# EAGLE design ATMEGA8 (EAGLE 9.4.2)
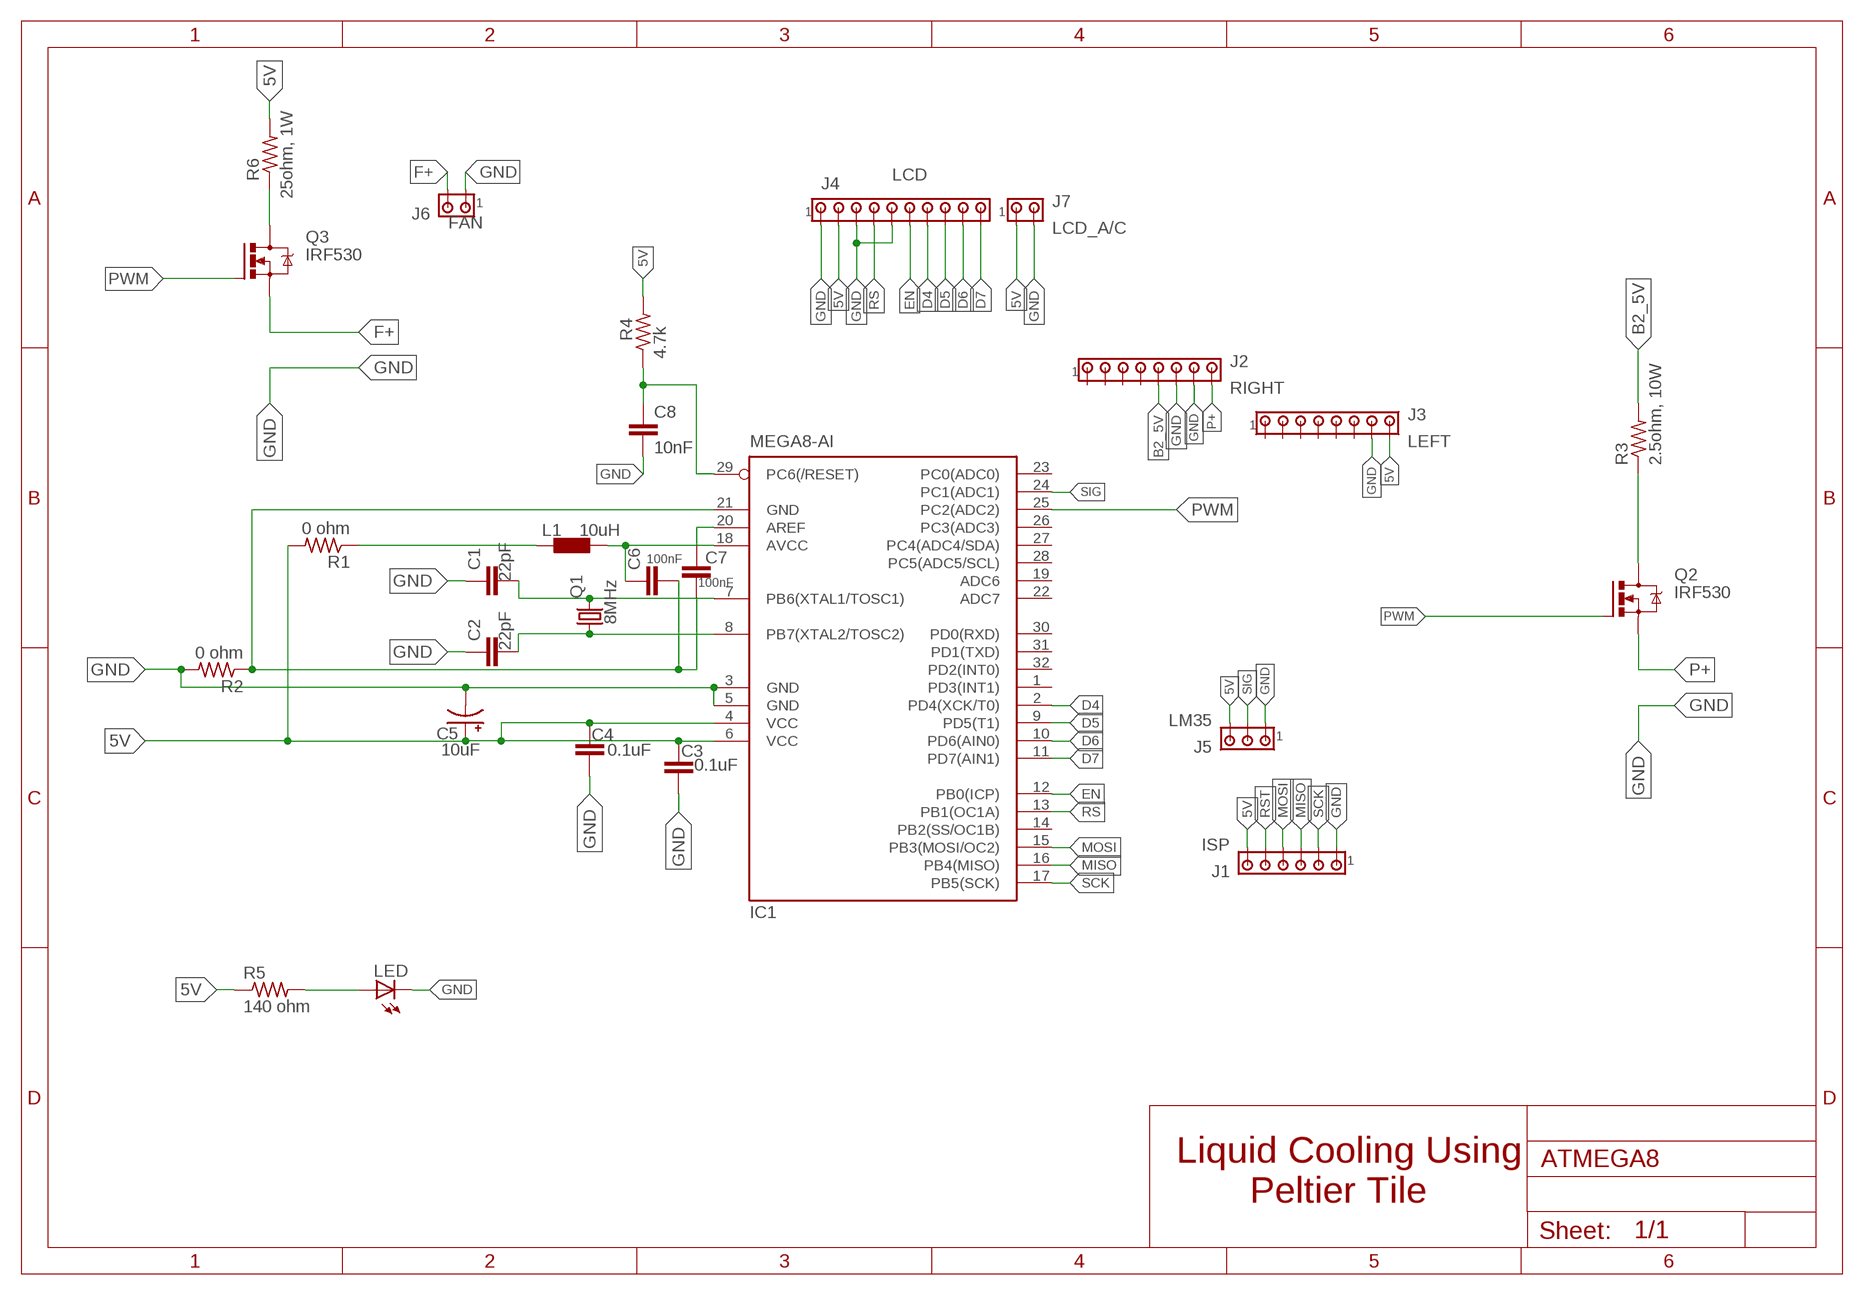
[diagram p0: schematic, sheet 1]

## Parts
C1  22pF  C-EUC0805  [C0805]
C2  22pF  C-EUC0805  [C0805]
C3  0.1uF  C-EUC0805  [C0805]
C4  0.1uF  C-EUC0805  [C0805]
C5  10uF  CPOL-USA/3216-18R  [A/3216-18R]
C6  100nF  C-EUC0805  [C0805]
C7  100nF  C-EUC0805  [C0805]
C8  10nF  C-EUC0805  [C0805]
IC1  MEGA8-AI  [TQFP32-08]
J1  ISP  MTA06-100  [10X06MTA]
J2  RIGHT  MTA08-100  [10X08MTA]
J3  LEFT  MTA08-100  [10X08MTA]
J4  LCD  MTA10-100  [10X10MTA]
J5  LM35  MTA03-100  [10X03MTA]
J6  FAN  MTA02-100  [10X02MTA]
J7  LCD_A/C  MTA02-100  [10X02MTA]
L1  10uH  L0204/7  [0204/7]
LED  RED  LEDCHIPLED_1206  [CHIPLED_1206]
Q1  8MHz  CSM-7X-DU  [CSM-7X-DU]
Q2  IRF530  [TO220BV]
Q3  IRF530  [TO220BV]
R1  0 ohm  R-US_M0805  [M0805]
R2  0 ohm  R-US_M0805  [M0805]
R3  2.5ohm, 10W  R-US_0207/9  [0207/9]
R4  4.7k  R-US_M0805  [M0805]
R5  140 ohm  R-US_M0805  [M0805]
R6  25ohm, 1W  R-US_0207/10  [0207/10]

## Nets
5V: C3.1 C4.1 C5.+ IC1.4(VCC) IC1.6(VCC) J1.6 J3.8 J4.2 J5.3 J7.1 R1.2 R4.2 R5.1 R6.2
B2_5V: J2.5 R3.2
D4: IC1.2(PD4(XCK/T0)) J4.7
D5: IC1.9(PD5(T1)) J4.8
D6: IC1.10(PD6(AIN0)) J4.9
D7: IC1.11(PD7(AIN1)) J4.10
EN: IC1.12(PB0(ICP)) J4.6
F+: J6.2 Q3.S
GND: C1.1 C2.1 C3.2 C4.2 C5.- C8.2 IC1.3(GND) IC1.5(GND) J1.1 J2.6 J2.7 J3.7 J4.1 J4.3 J4.5 J5.1 J6.1 J7.2 LED.C R2.2
MISO: IC1.16(PB4(MISO)) J1.3
MOSI: IC1.15(PB3(MOSI/OC2)) J1.4
N$1: C1.2 IC1.7(PB6(XTAL1/TOSC1)) Q1.2
N$2: C2.2 IC1.8(PB7(XTAL2/TOSC2)) Q1.1
N$3: C6.1 IC1.18(AVCC) L1.2
N$4: Q2.D R3.1
N$5: L1.1 R1.1
N$6: C6.2 C7.2 IC1.21(GND) R2.1
N$7: C7.1 IC1.20(AREF)
N$8: C8.1 IC1.29(PC6(/RESET)) R4.1
N$9: LED.A R5.2
N$10: Q3.D R6.1
P+: J2.8 Q2.S
PWM: IC1.25(PC2(ADC2)) Q2.G Q3.G
RS: IC1.13(PB1(OC1A)) J4.4
RST: J1.5
SCK: IC1.17(PB5(SCK)) J1.2
SIG: IC1.24(PC1(ADC1)) J5.2
Unconnected: IC1.1(PD3(INT1)) IC1.14(PB2(SS/OC1B)) IC1.19(ADC6) IC1.22(ADC7) IC1.23(PC0(ADC0)) IC1.26(PC3(ADC3)) IC1.27(PC4(ADC4/SDA)) IC1.28(PC5(ADC5/SCL)) IC1.30(PD0(RXD)) IC1.31(PD1(TXD)) IC1.32(PD2(INT0)) J2.1 J2.2 J2.3 J2.4 J3.1 J3.2 J3.3 J3.4 J3.5 J3.6

## Notes on the sheet
- Liquid Cooling Using
         Peltier Tile

## Library data of the parts
C1-C4 C6-C8 = rcl:C-EU: CAPACITOR, European symbol; SPICEPREFIX: C
C5 = rcl:CPOL-US: POLARIZED CAPACITOR, American symbol; SPICEPREFIX: C
IC1 = atmel:MEGA8: MICROCONTROLLER 8 Kbytes FLASH, 1 kbytes SRAM, 512 bytes EEPROM, USART, 6-channel 10 bit ADC, 2-channel 8 bit ADC Pin compatible with Atmega48, ATMega88, ATMega168 Source: avr.lbr; MPN: ATMEGA8-16AU; OC_FARNELL: 9171371; OC_NEWARK: 73M8863
J1 = con-amp:MTA06-100: AMP connector Connection corrected 2014-09-19
J2 J3 = con-amp:MTA08-100: AMP connector
J4 = con-amp:MTA10-100: AMP connector
J5 = con-amp:MTA03-100: AMP connector
J6 J7 = con-amp:MTA02-100: AMP connector
L1 = eagle-ltspice:L: INDUCTOR, European symbol; SPICEMODEL: NONE; SPICEPREFIX: L
LED = adafruit:LED: LED OSRAM: - CHIPLED LG R971, LG N971, LY N971, LG Q971, LY Q971, LO R971, LY R971 LH N974, LH R974 LS Q976, LO Q976, LY Q976 LO Q996 - Hyper CHIPLED LW Q18S LB Q993, LB Q99A, LB R99A - SideLED LS A670, LO A670, LY A670, LG A670, LP A670 LB A673, LV A673, LT A673, LW A673 LH A674 LY A675 LS A676, LA A676, LO A676, LY A676, LW A676 LS A679, LY A679, LG A679 - Hyper Micro SIDELED® LS Y876, LA Y876, LO Y876, LY Y876 LT Y87S - SmartLED LW L88C, LW L88S LB L89C, LB L89S, LG L890 LS L89K, LO L89K, LY L89K LS L896, LA L896, LO L896, LY L896 - TOPLED LS T670, LO T670, LY T670, LG T670, LP T670 LSG T670, LSP T670, LSY T670, LOP T670, LYG T670 LG T671, LOG T671, LSG T671 LB T673, LV T673, LT T673, LW T673 LH T674 LS T676, LA T676, LO T676, LY T676, LB T676, LH T676, LSB T676, LW T676 LB T67C, LV T67C, LT T67C, LS T67K, LO T67K, LY T67K, LW E67C LS E67B, LA E67B, LO E67B, LY E67B, LB E67C, LV E67C, LT E67C LW T67C LS T679, LY T679, LG T679 LS T770, LO T770, LY T770, LG T770, LP T770 LB T773, LV T773, LT T773, LW T773 LH T774 LS E675, LA E675, LY E675, LS T675 LS T776, LA T776, LO T776, LY T776, LB T776 LHGB T686 LT T68C, LB T68C - Hyper Mini TOPLED® LB M676 - Mini TOPLED Santana® LG M470 LS M47K, LO M47K, LY M47K Source: http://www.osram.convergy.de/
Q1 = crystal:CSM-7X-DU: SMD CRYSTAL Source: www.ecsxtal.com .. Crystal 3.6864MHz CSM_7X_DU.PDF; OC_FARNELL: unknown; OC_NEWARK: unknown
Q2 Q3 = transistor-power:IRF530: HEXFET Power MOSFET
R1 R2 R4 R5 = rcl:R-US_: RESISTOR, American symbol; SPICEPREFIX: R
R3 R6 = adafruit:R-US_: RESISTOR, American symbol

## Board
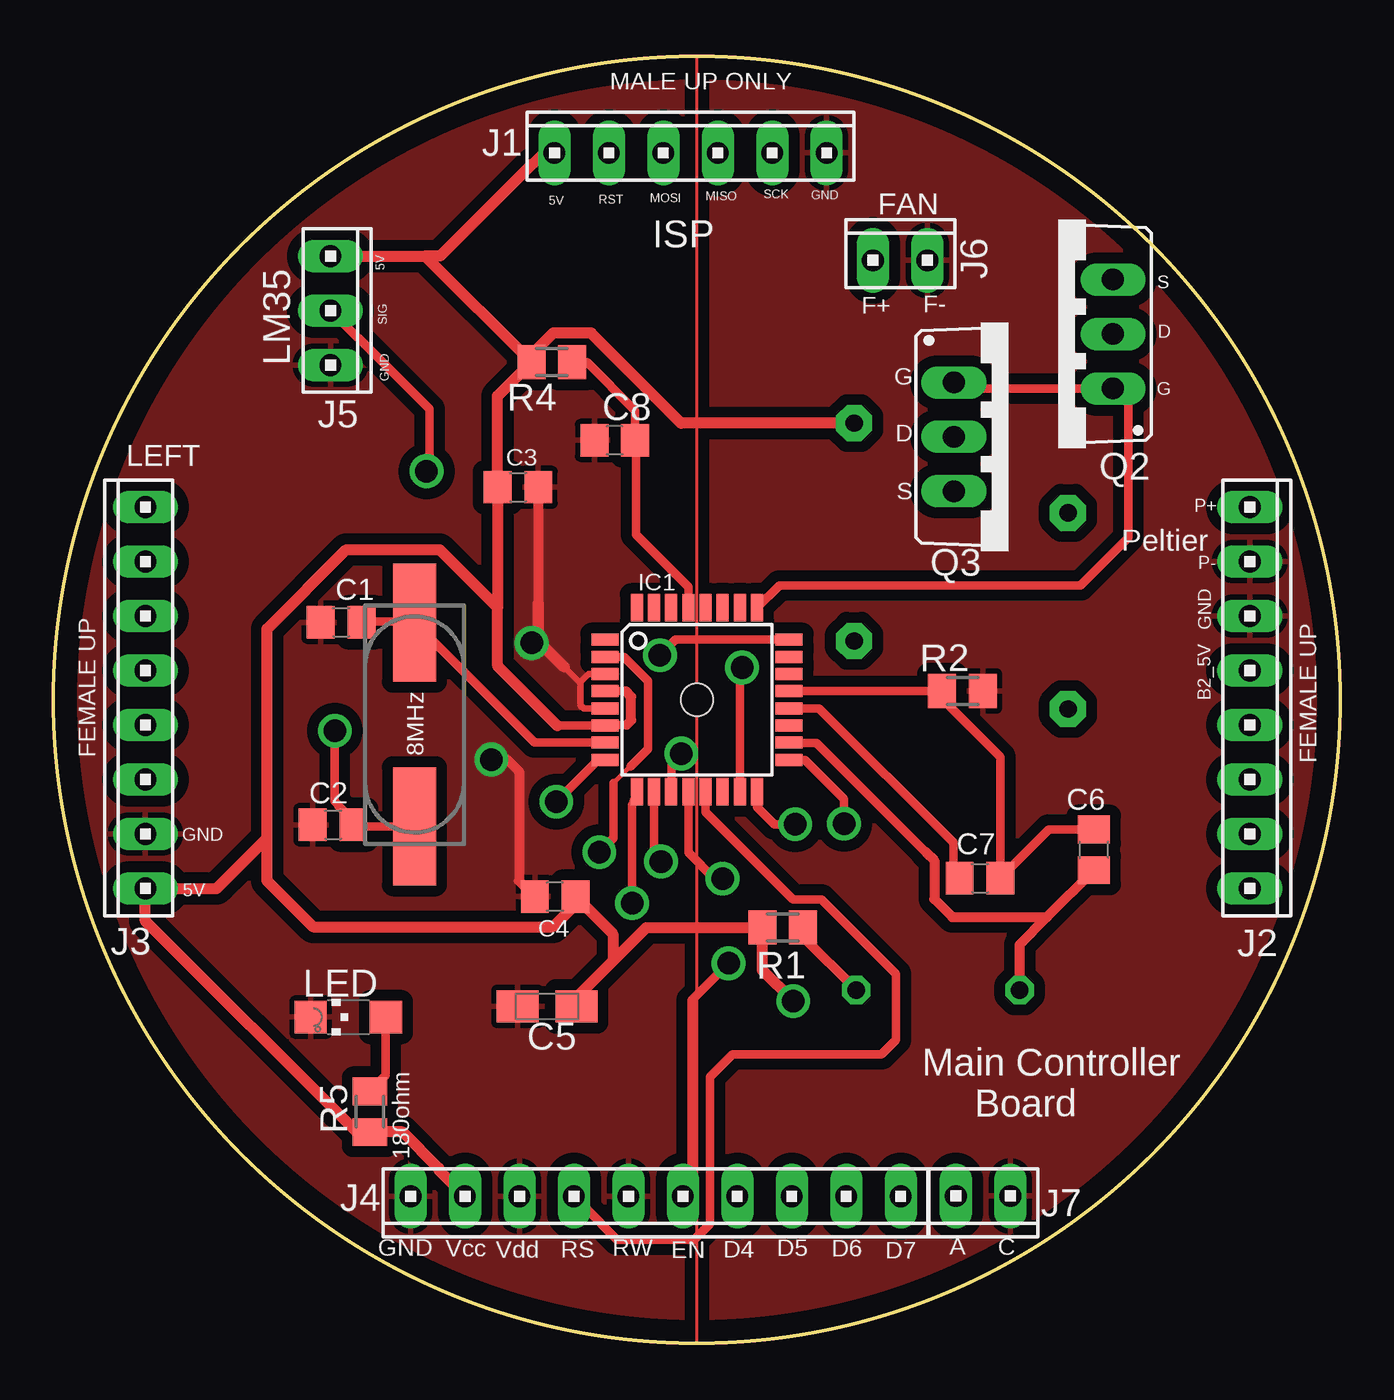
[diagram p1: board, top side]
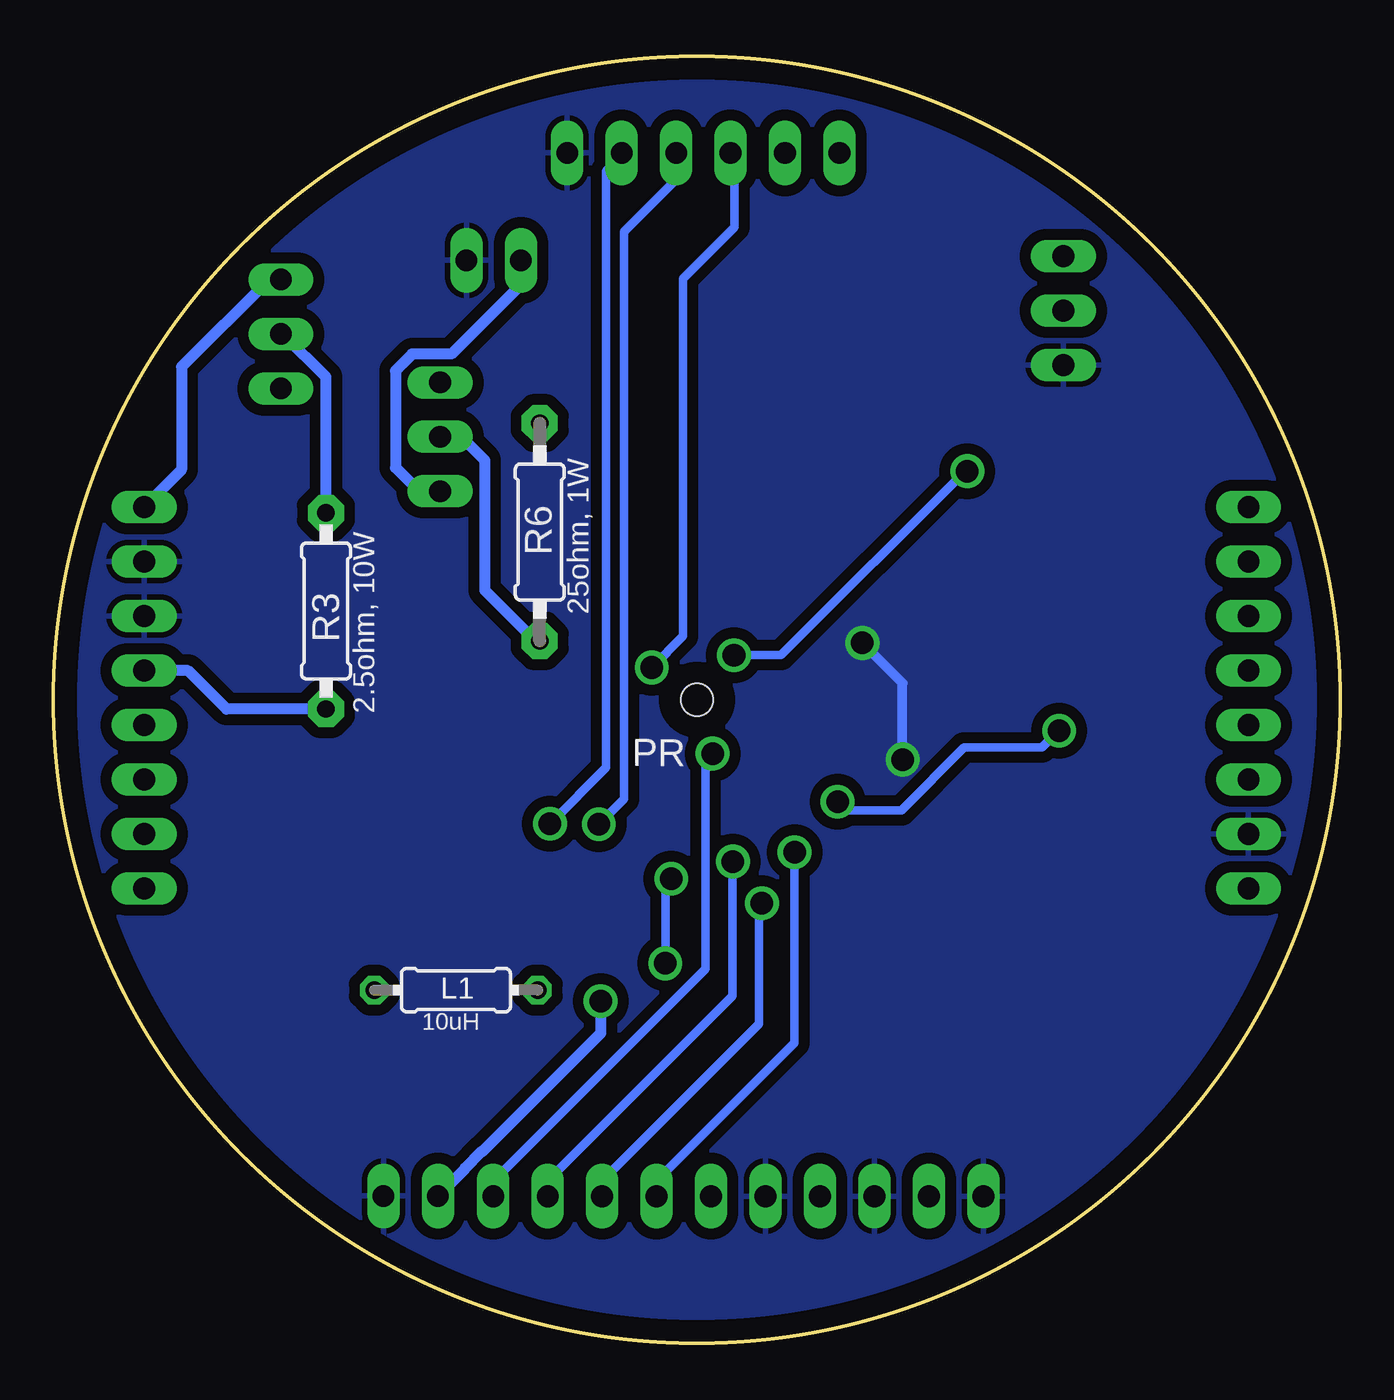
[diagram p2: board, bottom side, seen from below]

Size 60 x 60 mm. Coordinates in mm from the lower left corner, seen from the top.
Outline: circle at 30,30 radius 30
Copper layers (1*16): Top 0.035mm / dielectric 1.5mm / Bottom 0.035mm
Design rules "default *": minimum track width 8mil, minimum drill 0.35mm, track to track 12mil, track to pad 12mil, pad to pad 8mil, via to via 8mil, smd to smd 8mil, copper to edge 40mil, drill to drill 6mil, minimum pad ring 10mil, minimum via ring 8mil, stop-mask expansion 4mil, vias tented up to drill 0mil, thermal gap 10mil
Holes 1.5 mm at 30,30

### Footprints (pad centres in the part's own frame; a part is rotated, then mirrored left to right if it is on the bottom)
C0805 = smd 1.3 x 1.5: 1 -0.95,0; 2 0.95,0
A/3216-18R = smd 1.95 x 1.5: + 1.375,0; - -1.375,0
TQFP32-08 = smd 1.27 x 0.559: 1 -4.293,2.8; 2 -4.293,2; 3 -4.293,1.2; 4 -4.293,0.4; 5 -4.293,-0.4; 6 -4.293,-1.2; 7 -4.293,-2; 8 -4.293,-2.8; 17 4.293,-2.8; 18 4.293,-2; 19 4.293,-1.2; 20 4.293,-0.4; 21 4.293,0.4; 22 4.293,1.2; 23 4.293,2; 24 4.293,2.8 | smd 0.559 x 1.27: 9 -2.8,-4.293; 10 -2,-4.293; 11 -1.2,-4.293; 12 -0.4,-4.293; 13 0.4,-4.293; 14 1.2,-4.293; 15 2,-4.293; 16 2.8,-4.293; 25 2.8,4.293; 26 2,4.293; 27 1.2,4.293; 28 0.4,4.293; 29 -0.4,4.293; 30 -1.2,4.293; 31 -2,4.293; 32 -2.8,4.293
10X06MTA = drill 1.016 long: 1 6.35,0; 2 3.81,0; 3 1.27,0; 4 -1.27,0; 5 -3.81,0; 6 -6.35,0
10X08MTA = drill 1.016 long: 1 8.89,0; 2 6.35,0; 3 3.81,0; 4 1.27,0; 5 -1.27,0; 6 -3.81,0; 7 -6.35,0; 8 -8.89,0
10X10MTA = drill 1.016 long: 1 11.43,0; 2 8.89,0; 3 6.35,0; 4 3.81,0; 5 1.27,0; 6 -1.27,0; 7 -3.81,0; 8 -6.35,0; 9 -8.89,0; 10 -11.43,0
10X03MTA = drill 1.016 long: 1 2.54,0; 2 0,0; 3 -2.54,0
10X02MTA = drill 1.016 long: 1 1.27,0; 2 -1.27,0
0204/7 = drill 0.813 octagon: 1 -3.81,0; 2 3.81,0
CHIPLED_1206 = smd 1.5 x 1.5: A 0,-1.75; C 0,1.75
CSM-7X-DU = smd 5.5 x 2: 1 -4.75,0; 2 4.75,0
TO220BV = drill 1.016 long: D 0,-2.54; G -2.54,-2.54; S 2.54,-2.54
M0805 = smd 1.3 x 1.6: 1 -0.95,0; 2 0.95,0
0207/9 = drill 0.813 pad 1.676 octagon: 1 -4.572,0; 2 4.572,0
0207/10 = drill 0.813 pad 1.676 octagon: 1 -5.08,0; 2 5.08,0

### Placement (x,y rotation side)
C1  13.41,33.61 0 top
C2  13.03,24.17 0 top
C3  21.65,39.91 0 top
C4  23.39,20.82 180 top
C5  23.01,15.7 0 top
C6  48.51,23 90 top
C7  43.2,21.68 0 top
C8  26.17,42.1 180 top
IC1  30,30 0 top
J1  29.7,55.5 0 top
J2  55.78,30.09 270 top
J3  4.28,30.09 90 top
J4  28.07,6.85 180 top
J5  12.91,48.15 270 top
J6  39.48,50.49 0 top
J7  43.35,6.86 180 top
L1  41.24,16.46 180 bottom
LED  13.74,15.2 90 top
Q1  16.83,28.85 90 top
Q2  46.86,47.06 90 top
Q3  44.52,42.26 270 top
R1  34,19.38 180 top
R2  42.38,30.41 0 top
R3  47.3,34.14 270 bottom
R4  23.23,45.74 180 top
R5  14.75,10.79 90 top
R6  37.33,37.82 90 bottom

### Tracks (layer width: path | path; a pad name or v marks a point on that pad's centre or on a via)
5V  (via drill 1.05)
  Top 0.406: 23.48,28.8 IC1.6 25.72,28.81 26.7,28.81 26.73,28.84 | 26.67,30.4 IC1.4
  Top 0.457: 26.67,30.4 26.93,30.14 26.93,29.04 26.73,28.84 | C4.1 24.65,20.51 24.38,20.51 | C5.+ 24.38,16.13 | 22.36,45.82 R4.2 | 22.36,55.02 22.84,55.5 J1.6
  Top 0.508: 23.48,28.8 20.71,31.57 20.71,34.3 | 20.71,34.3 C3.1 20.7,44.16 R4.2 17.33,50.69 | 24.38,16.13 26.09,17.83 | 26.09,17.83 27.64,19.38 R1.2 33.05,17.39 v34.49,15.95 | J5.3 17.33,50.69 | 20.71,34.3 18.01,37 13.64,37 9.95,33.31 9.95,23.55 | 9.95,23.55 9.95,21.56 12.1,19.41 23.28,19.41 24.38,20.51 | C4.1 26.09,19.08 26.09,17.83 | 9.95,23.55 7.6,21.2 J3.8 4.28,19.68 14.12,9.84 R5.1 16.28,9.84 17.96,8.16 17.96,8.07 J4.2 | R6.2 29.26,42.9 25.06,47.1 23.3,47.1 22.36,46.16 22.36,45.82 | 22.36,55.02 18.03,50.69 17.33,50.69
  Bottom 0.508: J7.1 40.82,8.12 40.82,8.16 40.05,8.93 40.01,8.93 34.48,14.46 v34.48,15.95 v34.49,15.95
B2_5V
  Bottom 0.508: R3.2 51.94,29.57 53.73,31.36 J2.5
D4  (via drill 1.05)
  Top 0.203: 27.72,27.71 27.72,27.73 | 26.89,26.89 26.88,26.89 26.12,26.12
  Top 0.406: 27.72,27.73 27.72,30.88 26.6,32 IC1.2 | 26.12,26.12 26.12,23.56 v25.45,22.89 | 26.89,26.89 27.72,27.71
  Bottom 0.406: v25.45,22.89 25.45,14.01 31.98,7.47 J4.7
D5  (via drill 1.05)
  Top 0.406: v26.97,20.51 26.97,25.1 IC1.9
  Bottom 0.406: v26.97,20.51 27.1,20.38 27.1,14.89 34.52,7.47 J4.8
D6  (via drill 1.05)
  Top 0.406: v28.32,22.45 28,22.78 28,25.52 28,25.51 IC1.10
  Bottom 0.406: v28.32,22.45 28.34,22.43 28.34,16.19 37.06,7.47 J4.9
D7  (via drill 1.05)
  Top 0.305: 28.81,26.19 28.8,26.18 IC1.11
  Top 0.406: 28.81,26.19 28.81,27.03 v29.27,27.49
  Bottom 0.406: v29.27,27.49 29.6,27.16 29.6,17.45 39.5,7.55 J4.10
EN  (via drill 1.05)
  Top 0.406: v31.47,17.71 29.75,15.99 29.75,7.26 J4.6 | IC1.12 29.6,22.87 30.81,21.65 v31.19,21.65
  Bottom 0.406: v31.47,17.71 31.47,21.37 v31.19,21.65
F+
  Bottom 0.508: Q3.S 42.96,39.72 44.06,40.82 44.06,45.35 43.29,46.12 41.45,46.12 38.21,49.36 J6.2
GND  (via drill 1.05)
  Top 0.305: 24.58,30.76 24.58,29.74 24.73,29.59 25.7,29.59 IC1.5 | 23.81,31.53 24.58,30.76 | IC1.3 24.95,31.2 24.58,30.83 24.58,30.76
  Top 0.457: C3.2 22.6,34.51 | C4.2 21.7,21.56 21.7,26.66 21.15,27.21 v20.41,27.21
  Top 0.508: 22.6,34.51 22.6,32.96 v22.29,32.65 22.69,32.65 23.81,31.53
  Bottom 0.457: v20.41,27.21 20.41,30.77 v22.29,32.65
  pour Top (isolate 0.508): -3.02,60.72 -3.02,-0.51 61.78,-0.51 61.78,60.72
  pour Bottom (isolate 0.508): -2.92,60.77 -2.92,-0.21 60.98,-0.21 60.98,60.77
MISO  (via drill 1.05)
  Top 0.406: v34.58,24.19 33.6,24.19 32.8,25 IC1.16
  Bottom 0.406: v34.58,24.19 33.41,25.36 33.41,51.83 30.79,54.45 30.79,55.35 J1.3
MOSI  (via drill 1.05)
  Top 0.406: v32.11,31.5 32,31.39 32,25.72 IC1.15
  Bottom 0.406: v32.11,31.5 30.65,32.96 30.65,49.64 28.25,52.03 28.25,55.35 J1.4
N$1
  Top 0.406: IC1.7 22.43,28 Q1.2 16.66,33.65 14.44,33.65 C1.2
N$2  (via drill 1.05)
  Top 0.406: IC1.8 25.4,27.2 v23.44,25.25 | 14.09,24.25 14.25,24.38 14.53,24.1 Q1.1 | 14.09,24.25 C2.2 | v13.12,28.56 13.12,25.25 13.24,25.13 13.24,25.1 14.09,24.25
  Bottom 0.406: 23.04,24.84 20.48,24.84 17.55,27.77 13.91,27.77 v13.12,28.56
  Bottom 0.457: v23.44,25.25 23.04,24.84
N$3
  Top 0.406: IC1.18 34.3,27.99 35.57,27.99 40.68,22.88
  Top 0.457: L1.2 45.05,18.59 46.33,19.87 | 46.33,19.87 C6.1 | 40.68,22.88 41.07,22.5 41.07,20.71 41.91,19.87 46.33,19.87
N$4
  Bottom 0.508: R3.1 47.3,45.05 49.31,47.06 Q2.D
N$5
  Top 0.457: L1.1 34.95,18.94 R1.1
N$6
  Top 0.406: IC1.21 R2.1 41.43,30.06 44.15,27.34 C7.2 46.42,23.95 C6.2
N$7
  Top 0.406: IC1.20 35.7,29.6 41.95,23.34 41.95,21.98 C7.1
N$8
  Top 0.406: IC1.29 29.6,35.26 27.16,37.7 27.16,42.06 C8.1 27.12,43.49 24.87,45.74 R4.1
N$9
  Top 0.406: LED.A 15.49,12.48 R5.2
N$10
  Bottom 0.508: R6.1 37.53,32.74 39.9,35.11 39.9,41.17 40.99,42.26 Q3.D
P+
  Bottom 0.508: J2.8 54.03,40.73 54.03,45.53 49.96,49.6 Q2.S
PWM
  Top 0.406: Q3.G 42.26,44.52 Q2.G 50.11,43.81 50.11,37.57 47.88,35.34 33.84,35.34 IC1.25
RS
  Top 0.406: IC1.13 30.4,24.76 34.47,20.69 35.81,20.69 39.29,17.21 39.29,14.15 38.6,13.46 31.65,13.46 30.61,12.42 30.61,5.56 29.87,4.82 26.27,4.82 25.53,5.56 25.53,5.58 J4.4
SCK  (via drill 1.05)
  Top 0.406: v36.86,24.22 36.86,25.38 35.03,27.2 IC1.17
  Bottom 0.406: J1.2 33.51,55.38 34.24,54.65 34.24,26.83 v36.86,24.22
SIG  (via drill 1.05)
  Top 0.406: IC1.24 28.99,32.8 v28.27,32.08 | v17.39,40.66 17.53,40.8 17.53,43.55 14.2,46.88 14.18,46.88 J5.2
  Bottom 0.406: v28.27,32.08 26.07,32.08 17.49,40.66 v17.39,40.66
(copper drawn outside any net)
  shapes: Top area x1

### Text on the board
tNames: MALE UP ONLY | 5V | RST | MOSI | MISO | SCK | GND | FAN | ISP | LM35 | 5V | S | F+ | F- | SIG | D | GND | G | G | D | LEFT | S | P+ | Peltier | P- | GND | B2_5V | FEMALE UP | 8MHz | FEMALE UP | GND | 5V | 180ohm | Main Controller / Board | Vdd | D7 | GND | Vcc | RS | RW | EN | D4 | D5 | D6 | A | C
bNames: 25ohm, 1W | 2.5ohm, 10W | PR | 10uH